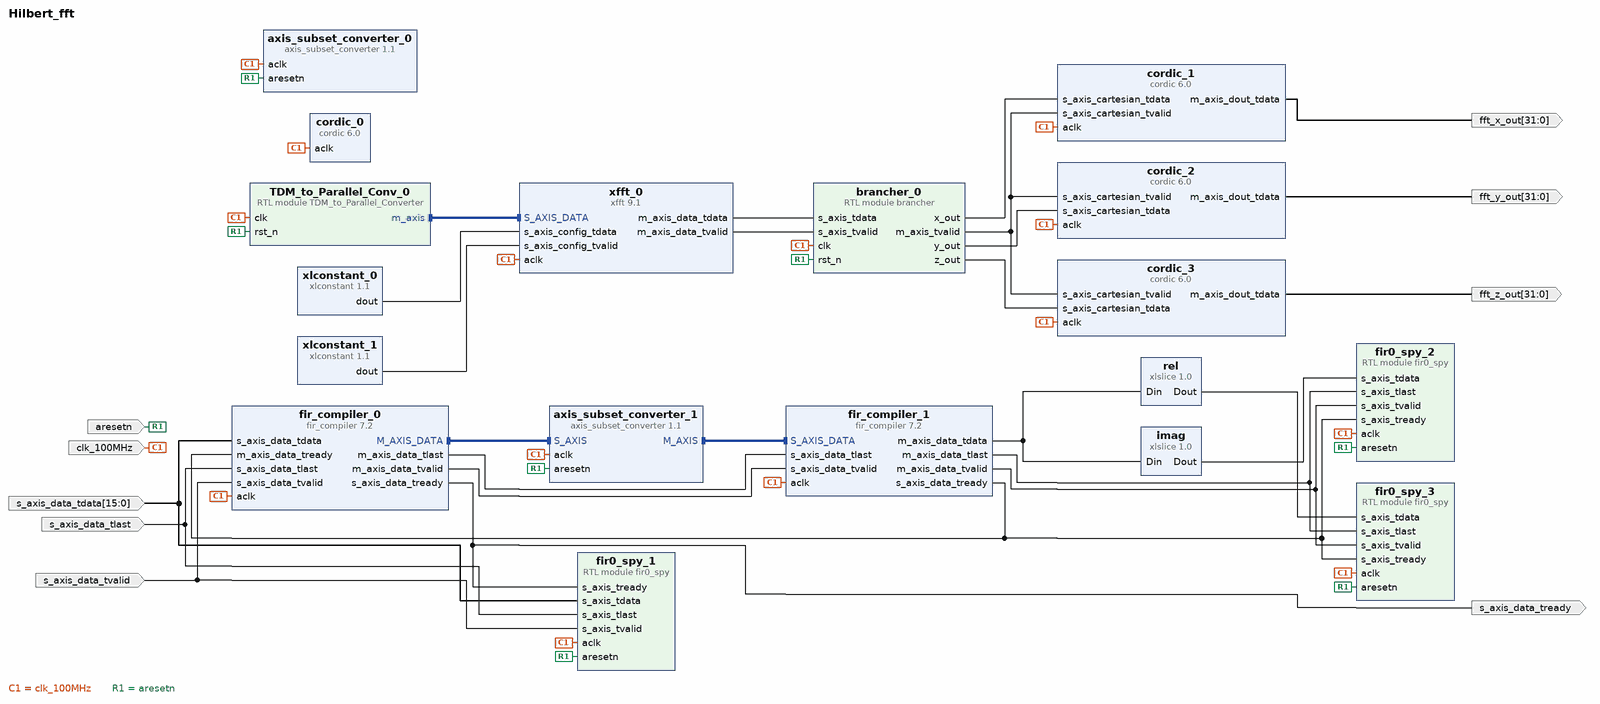
[diagram p0: block diagram of the top level]
# Vivado block design Hilbert_fft, xck26-sfvc784-2LV-c, Vivado 2025.2
create_bd_design Hilbert_fft

create_bd_port -dir I -type clk clk_100MHz
set_property -dict {CONFIG.FREQ_HZ 100000000} [get_bd_ports clk_100MHz]
create_bd_port -dir I -type rst aresetn
create_bd_port -dir I s_axis_data_tvalid
create_bd_port -dir I s_axis_data_tlast
create_bd_port -dir I -from 15 -to 0 -type data s_axis_data_tdata
create_bd_port -dir O s_axis_data_tready
create_bd_port -dir O -from 31 -to 0 -type data fft_x_out
create_bd_port -dir O -from 31 -to 0 -type data fft_y_out
create_bd_port -dir O -from 31 -to 0 -type data fft_z_out

create_bd_cell -type ip -vlnv xilinx.com:ip:fir_compiler:7.2 fir_compiler_0
set_property -dict [list \
  CONFIG.BestPrecision true \
  CONFIG.Channel_Sequence Basic \
  CONFIG.Clock_Frequency 100.0 \
  CONFIG.CoefficientSource COE_File \
  CONFIG.Coefficient_File ../../../../../../../../COE_File/filet_2.coe \
  CONFIG.Coefficient_Fractional_Bits 16 \
  CONFIG.Coefficient_Sets 1 \
  CONFIG.Coefficient_Sign Signed \
  CONFIG.Coefficient_Structure Inferred \
  CONFIG.Coefficient_Width 16 \
  CONFIG.DATA_Has_TLAST Packet_Framing \
  CONFIG.Decimation_Rate 1 \
  CONFIG.Filter_Architecture Systolic_Multiply_Accumulate \
  CONFIG.Filter_Type Single_Rate \
  CONFIG.Interpolation_Rate 1 \
  CONFIG.M_DATA_Has_TREADY true \
  CONFIG.M_DATA_Has_TUSER Not_Required \
  CONFIG.Number_Channels 3 \
  CONFIG.Output_Rounding_Mode Full_Precision \
  CONFIG.Output_Width 34 \
  CONFIG.Quantization Maximize_Dynamic_Range \
  CONFIG.RateSpecification Frequency_Specification \
  CONFIG.S_DATA_Has_TUSER Not_Required \
  CONFIG.Sample_Frequency 0.02667 \
  CONFIG.Select_Pattern All \
  CONFIG.Zero_Pack_Factor 1 \
] [get_bd_cells fir_compiler_0]
create_bd_cell -type ip -vlnv xilinx.com:ip:cordic:6.0 cordic_0
set_property -dict [list \
  CONFIG.Compensation_Scaling No_Scale_Compensation \
  CONFIG.Data_Format SignedFraction \
  CONFIG.Functional_Selection Translate \
  CONFIG.Pipelining_Mode Optimal \
  CONFIG.Round_Mode Nearest_Even \
  CONFIG.cartesian_has_tlast true \
  CONFIG.flow_control Blocking \
  CONFIG.out_tlast_behv Pass_Cartesian_TLAST \
] [get_bd_cells cordic_0]
create_bd_cell -type ip -vlnv xilinx.com:ip:axis_subset_converter:1.1 axis_subset_converter_0
set_property -dict [list \
  CONFIG.HAS_ACLKEN 0 \
  CONFIG.M_HAS_TKEEP 0 \
  CONFIG.M_HAS_TLAST 1 \
  CONFIG.M_HAS_TREADY 1 \
  CONFIG.M_HAS_TSTRB 0 \
  CONFIG.M_TDATA_NUM_BYTES 4 \
  CONFIG.M_TDEST_WIDTH 0 \
  CONFIG.M_TID_WIDTH 0 \
  CONFIG.M_TUSER_WIDTH 0 \
  CONFIG.S_HAS_TKEEP 0 \
  CONFIG.S_HAS_TLAST 1 \
  CONFIG.S_HAS_TREADY 1 \
  CONFIG.S_HAS_TSTRB 0 \
  CONFIG.S_TDATA_NUM_BYTES 4 \
  CONFIG.S_TDEST_WIDTH 0 \
  CONFIG.S_TID_WIDTH 0 \
  CONFIG.S_TUSER_WIDTH 0 \
] [get_bd_cells axis_subset_converter_0]
create_bd_cell -type ip -vlnv xilinx.com:ip:xfft:9.1 xfft_0
set_property -dict [list \
  CONFIG.channels 3 \
  CONFIG.implementation_options automatically_select \
  CONFIG.number_of_stages_using_block_ram_for_data_and_phase_factors 0 \
  CONFIG.output_ordering natural_order \
  CONFIG.super_sample_rates 1 \
  CONFIG.target_clock_frequency 100 \
  CONFIG.target_data_throughput 50 \
  CONFIG.transform_length 1024 \
] [get_bd_cells xfft_0]
create_bd_cell -type module -reference TDM_to_Parallel_Converter TDM_to_Parallel_Conv_0
create_bd_cell -type ip -vlnv xilinx.com:ip:xlconstant:1.1 xlconstant_0
set_property -dict {CONFIG.CONST_VAL 196765375672691108523 CONFIG.CONST_WIDTH 72} [get_bd_cells xlconstant_0]
create_bd_cell -type ip -vlnv xilinx.com:ip:xlconstant:1.1 xlconstant_1
create_bd_cell -type module -reference brancher brancher_0
create_bd_cell -type ip -vlnv xilinx.com:ip:cordic:6.0 cordic_1
set_property -dict [list \
  CONFIG.ARESETN false \
  CONFIG.Compensation_Scaling No_Scale_Compensation \
  CONFIG.Data_Format SignedFraction \
  CONFIG.Functional_Selection Translate \
  CONFIG.Pipelining_Mode Optimal \
  CONFIG.Round_Mode Nearest_Even \
] [get_bd_cells cordic_1]
create_bd_cell -type ip -vlnv xilinx.com:ip:cordic:6.0 cordic_2
set_property -dict [list \
  CONFIG.ARESETN false \
  CONFIG.Compensation_Scaling No_Scale_Compensation \
  CONFIG.Data_Format SignedFraction \
  CONFIG.Functional_Selection Translate \
  CONFIG.Pipelining_Mode Optimal \
  CONFIG.Round_Mode Nearest_Even \
] [get_bd_cells cordic_2]
create_bd_cell -type ip -vlnv xilinx.com:ip:cordic:6.0 cordic_3
set_property -dict [list \
  CONFIG.ARESETN false \
  CONFIG.Compensation_Scaling No_Scale_Compensation \
  CONFIG.Data_Format SignedFraction \
  CONFIG.Functional_Selection Translate \
  CONFIG.Pipelining_Mode Optimal \
  CONFIG.Round_Mode Nearest_Even \
] [get_bd_cells cordic_3]
create_bd_cell -type module -reference fir0_spy fir0_spy_1
create_bd_cell -type ip -vlnv xilinx.com:ip:fir_compiler:7.2 fir_compiler_1
set_property -dict [list \
  CONFIG.BestPrecision false \
  CONFIG.Clock_Frequency 100 \
  CONFIG.CoefficientSource COE_File \
  CONFIG.CoefficientVector 6,0,-4,-3,5,6,-6,-13,7,44,64,44,7,-13,-6,6,5,-3,-4,0,6 \
  CONFIG.Coefficient_File ../../../../../../../../../../hilbert_radix10.coe \
  CONFIG.Coefficient_Fractional_Bits 0 \
  CONFIG.Coefficient_Sets 1 \
  CONFIG.Coefficient_Sign Signed \
  CONFIG.Coefficient_Structure Hilbert \
  CONFIG.Coefficient_Width 16 \
  CONFIG.DATA_Has_TLAST Packet_Framing \
  CONFIG.Decimation_Rate 1 \
  CONFIG.Filter_Architecture Systolic_Multiply_Accumulate \
  CONFIG.Filter_Type Hilbert \
  CONFIG.Interpolation_Rate 1 \
  CONFIG.M_DATA_Has_TREADY true \
  CONFIG.M_DATA_Has_TUSER Not_Required \
  CONFIG.Number_Channels 3 \
  CONFIG.Output_Rounding_Mode Convergent_Rounding_to_Even \
  CONFIG.Output_Width 16 \
  CONFIG.Quantization Quantize_Only \
  CONFIG.RateSpecification Frequency_Specification \
  CONFIG.S_DATA_Has_TUSER Not_Required \
  CONFIG.Sample_Frequency 0.02667 \
  CONFIG.Select_Pattern All \
  CONFIG.Zero_Pack_Factor 1 \
] [get_bd_cells fir_compiler_1]
create_bd_cell -type ip -vlnv xilinx.com:ip:xlslice:1.0 imag
set_property -dict {CONFIG.DIN_FROM 31 CONFIG.DIN_TO 16} [get_bd_cells imag]
create_bd_cell -type ip -vlnv xilinx.com:ip:xlslice:1.0 rel
set_property -dict {CONFIG.DIN_FROM 15} [get_bd_cells rel]
create_bd_cell -type module -reference fir0_spy fir0_spy_2
create_bd_cell -type module -reference fir0_spy fir0_spy_3
create_bd_cell -type ip -vlnv xilinx.com:ip:axis_subset_converter:1.1 axis_subset_converter_1
set_property -dict [list \
  CONFIG.M_HAS_TKEEP 0 \
  CONFIG.M_HAS_TLAST 1 \
  CONFIG.M_HAS_TREADY 1 \
  CONFIG.M_HAS_TSTRB 0 \
  CONFIG.M_TDATA_NUM_BYTES 2 \
  CONFIG.M_TDEST_WIDTH 0 \
  CONFIG.M_TID_WIDTH 0 \
  CONFIG.M_TUSER_WIDTH 0 \
  CONFIG.S_HAS_TKEEP 0 \
  CONFIG.S_HAS_TLAST 1 \
  CONFIG.S_HAS_TREADY 1 \
  CONFIG.S_HAS_TSTRB 0 \
  CONFIG.S_TDATA_NUM_BYTES 5 \
  CONFIG.S_TDEST_WIDTH 0 \
  CONFIG.S_TID_WIDTH 0 \
  CONFIG.S_TUSER_WIDTH 0 \
  CONFIG.TDATA_REMAP {tdata[32:17]} \
] [get_bd_cells axis_subset_converter_1]

# ---- connections ----

connect_bd_intf_net [get_bd_intf_pins TDM_to_Parallel_Conv_0/m_axis] [get_bd_intf_pins xfft_0/S_AXIS_DATA]
connect_bd_intf_net [get_bd_intf_pins fir_compiler_1/S_AXIS_DATA] [get_bd_intf_pins axis_subset_converter_1/M_AXIS]
connect_bd_intf_net [get_bd_intf_pins axis_subset_converter_1/S_AXIS] [get_bd_intf_pins fir_compiler_0/M_AXIS_DATA]
connect_bd_net [get_bd_pins brancher_0/m_axis_tvalid] \
  [get_bd_pins cordic_2/s_axis_cartesian_tvalid] [get_bd_pins cordic_1/s_axis_cartesian_tvalid] \
  [get_bd_pins cordic_3/s_axis_cartesian_tvalid]
connect_bd_net [get_bd_pins brancher_0/x_out] [get_bd_pins cordic_1/s_axis_cartesian_tdata]
connect_bd_net [get_bd_pins brancher_0/y_out] [get_bd_pins cordic_2/s_axis_cartesian_tdata]
connect_bd_net [get_bd_pins brancher_0/z_out] [get_bd_pins cordic_3/s_axis_cartesian_tdata]
connect_bd_net [get_bd_ports clk_100MHz] \
  [get_bd_pins fir_compiler_0/aclk] [get_bd_pins cordic_0/aclk] [get_bd_pins axis_subset_converter_0/aclk] \
  [get_bd_pins xfft_0/aclk] [get_bd_pins TDM_to_Parallel_Conv_0/clk] [get_bd_pins cordic_2/aclk] [get_bd_pins cordic_3/aclk] \
  [get_bd_pins cordic_1/aclk] [get_bd_pins brancher_0/clk] [get_bd_pins fir0_spy_1/aclk] [get_bd_pins fir_compiler_1/aclk] \
  [get_bd_pins fir0_spy_3/aclk] [get_bd_pins fir0_spy_2/aclk] [get_bd_pins axis_subset_converter_1/aclk]
connect_bd_net [get_bd_pins cordic_1/m_axis_dout_tdata] [get_bd_ports fft_x_out]
connect_bd_net [get_bd_pins cordic_2/m_axis_dout_tdata] [get_bd_ports fft_y_out]
connect_bd_net [get_bd_pins cordic_3/m_axis_dout_tdata] [get_bd_ports fft_z_out]
connect_bd_net [get_bd_pins fir_compiler_0/m_axis_data_tlast] [get_bd_pins fir_compiler_1/s_axis_data_tlast]
connect_bd_net [get_bd_pins fir_compiler_0/m_axis_data_tvalid] [get_bd_pins fir_compiler_1/s_axis_data_tvalid]
connect_bd_net [get_bd_pins fir_compiler_0/s_axis_data_tready] [get_bd_ports s_axis_data_tready] [get_bd_pins fir0_spy_1/s_axis_tready]
connect_bd_net [get_bd_pins fir_compiler_1/m_axis_data_tdata] [get_bd_pins imag/Din] [get_bd_pins rel/Din]
connect_bd_net [get_bd_pins fir_compiler_1/m_axis_data_tlast] [get_bd_pins fir0_spy_3/s_axis_tlast] [get_bd_pins fir0_spy_2/s_axis_tlast]
connect_bd_net [get_bd_pins fir_compiler_1/m_axis_data_tvalid] [get_bd_pins fir0_spy_2/s_axis_tvalid] [get_bd_pins fir0_spy_3/s_axis_tvalid]
connect_bd_net [get_bd_pins fir_compiler_1/s_axis_data_tready] \
  [get_bd_pins fir_compiler_0/m_axis_data_tready] [get_bd_pins fir0_spy_2/s_axis_tready] \
  [get_bd_pins fir0_spy_3/s_axis_tready]
connect_bd_net [get_bd_pins imag/Dout] [get_bd_pins fir0_spy_2/s_axis_tdata]
connect_bd_net [get_bd_pins rel/Dout] [get_bd_pins fir0_spy_3/s_axis_tdata]
connect_bd_net -net reset_1 [get_bd_ports aresetn] \
  [get_bd_pins TDM_to_Parallel_Conv_0/rst_n] [get_bd_pins axis_subset_converter_0/aresetn] [get_bd_pins brancher_0/rst_n] \
  [get_bd_pins fir0_spy_1/aresetn] [get_bd_pins fir0_spy_3/aresetn] [get_bd_pins fir0_spy_2/aresetn] \
  [get_bd_pins axis_subset_converter_1/aresetn]
connect_bd_net [get_bd_ports s_axis_data_tdata] [get_bd_pins fir_compiler_0/s_axis_data_tdata] [get_bd_pins fir0_spy_1/s_axis_tdata]
connect_bd_net [get_bd_ports s_axis_data_tlast] [get_bd_pins fir_compiler_0/s_axis_data_tlast] [get_bd_pins fir0_spy_1/s_axis_tlast]
connect_bd_net [get_bd_ports s_axis_data_tvalid] [get_bd_pins fir_compiler_0/s_axis_data_tvalid] [get_bd_pins fir0_spy_1/s_axis_tvalid]
connect_bd_net [get_bd_pins xfft_0/m_axis_data_tdata] [get_bd_pins brancher_0/s_axis_tdata]
connect_bd_net [get_bd_pins xfft_0/m_axis_data_tvalid] [get_bd_pins brancher_0/s_axis_tvalid]
connect_bd_net [get_bd_pins xlconstant_0/dout] [get_bd_pins xfft_0/s_axis_config_tdata]
connect_bd_net [get_bd_pins xlconstant_1/dout] [get_bd_pins xfft_0/s_axis_config_tvalid]

validate_bd_design
save_bd_design
